# Altium schematic sheet DigitalOutputs.SchDoc
size A3; SheetNumber: 3; SheetTotal: 3
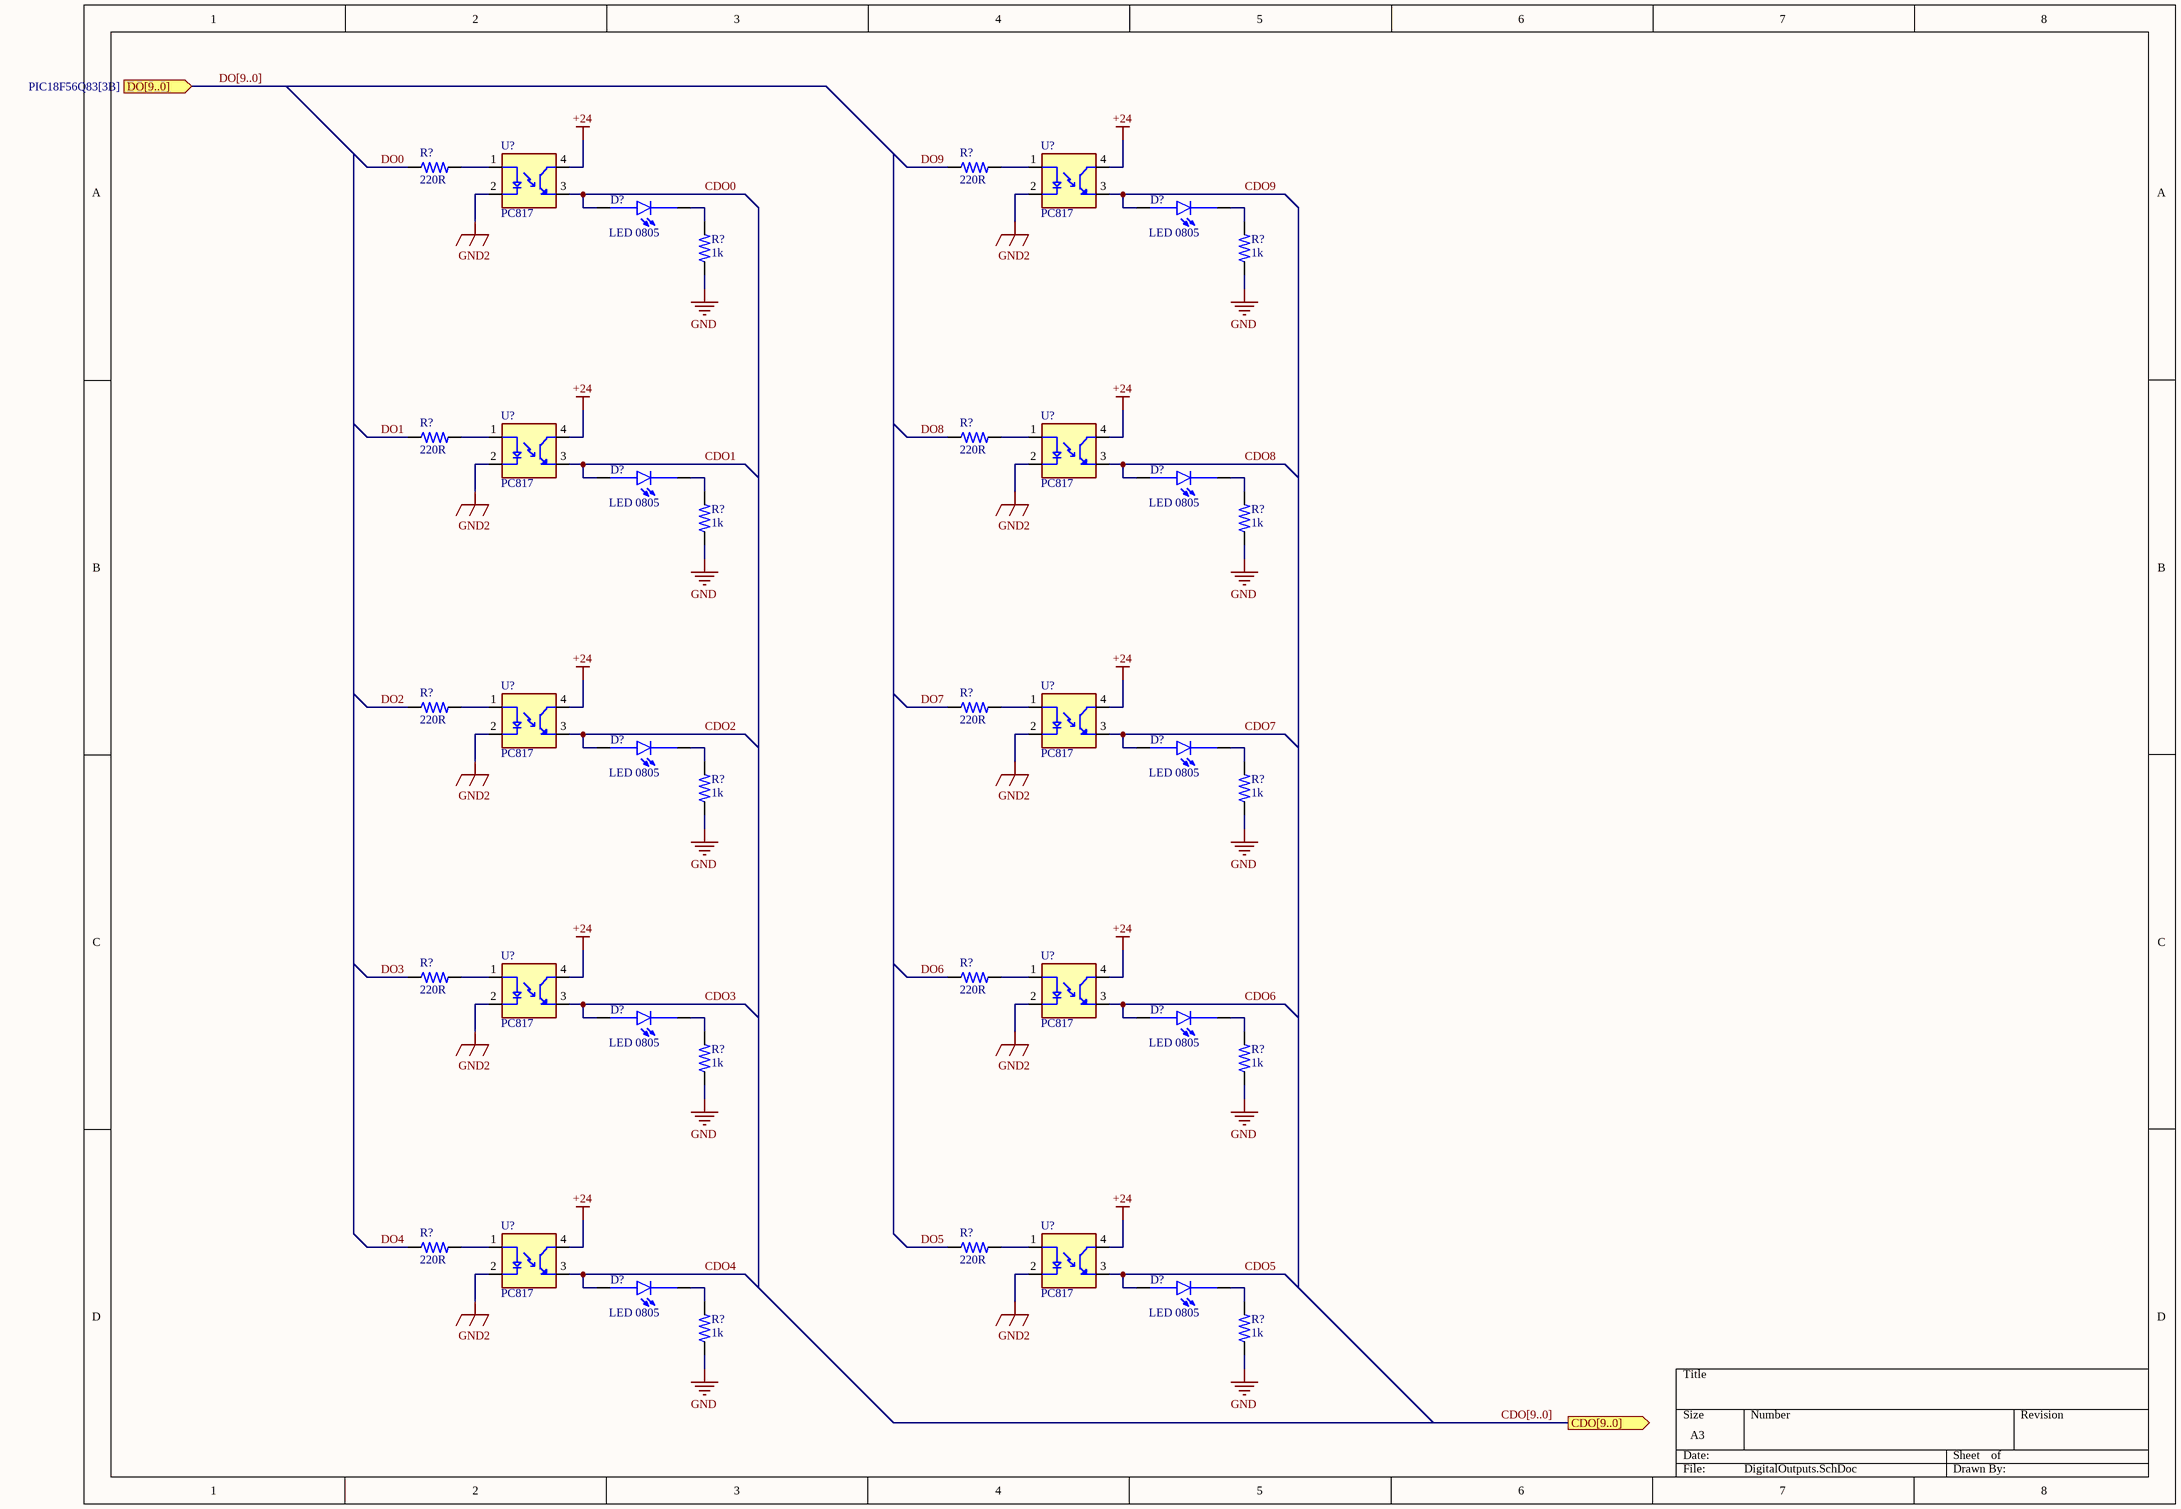
[diagram p0: DigitalOutputs.SchDoc]

## Parts
(Parts that share a designator on the sheet are numbered #1, #2 ... from top to bottom, then left to right.)
D?#1  LED 0805  [LED 0805]
D?#2  LED 0805  [LED 0805]
D?#3  LED 0805  [LED 0805]
D?#4  LED 0805  [LED 0805]
D?#5  LED 0805  [LED 0805]
D?#6  LED 0805  [LED 0805]
D?#7  LED 0805  [LED 0805]
D?#8  LED 0805  [LED 0805]
D?#9  LED 0805  [LED 0805]
D?#10  LED 0805  [LED 0805]
R?#1  220R  [0805]
R?#2  220R  [0805]
R?#3  1k  [0805]
R?#4  1k  [0805]
R?#5  220R  [0805]
R?#6  220R  [0805]
R?#7  1k  [0805]
R?#8  1k  [0805]
R?#9  220R  [0805]
R?#10  220R  [0805]
R?#11  1k  [0805]
R?#12  1k  [0805]
R?#13  220R  [0805]
R?#14  220R  [0805]
R?#15  1k  [0805]
R?#16  1k  [0805]
R?#17  220R  [0805]
R?#18  220R  [0805]
R?#19  1k  [0805]
R?#20  1k  [0805]
U?#1  PC817  [PC817]
U?#2  PC817  [PC817]
U?#3  PC817  [PC817]
U?#4  PC817  [PC817]
U?#5  PC817  [PC817]
U?#6  PC817  [PC817]
U?#7  PC817  [PC817]
U?#8  PC817  [PC817]
U?#9  PC817  [PC817]
U?#10  PC817  [PC817]

## Ports
CDO[9..0] (out), DO[9..0] (in, see PIC18F56Q83[3B])

## Nets
+24: U?#1.4(CT) U?#2.4(CT) U?#3.4(CT) U?#4.4(CT) U?#5.4(CT) U?#6.4(CT) U?#7.4(CT) U?#8.4(CT) U?#9.4(CT) U?#10.4(CT)
GND: R?#3.1 R?#4.1 R?#7.1 R?#8.1 R?#11.1 R?#12.1 R?#15.1 R?#16.1 R?#19.1 R?#20.1
GND2: U?#1.2(C) U?#2.2(C) U?#3.2(C) U?#4.2(C) U?#5.2(C) U?#6.2(C) U?#7.2(C) U?#8.2(C) U?#9.2(C) U?#10.2(C)
CDO0: D?#1.A U?#1.3(ET)
CDO1: D?#3.A U?#3.3(ET)
CDO2: D?#5.A U?#5.3(ET)
CDO3: D?#7.A U?#7.3(ET)
CDO4: D?#9.A U?#9.3(ET)
CDO5: D?#10.A U?#10.3(ET)
CDO6: D?#8.A U?#8.3(ET)
CDO7: D?#6.A U?#6.3(ET)
CDO8: D?#4.A U?#4.3(ET)
CDO9: D?#2.A U?#2.3(ET)
DO0: R?#1.1
DO1: R?#5.1
DO2: R?#9.1
DO3: R?#13.1
DO4: R?#17.1
DO5: R?#18.1
DO6: R?#14.1
DO7: R?#10.1
DO8: R?#6.1
DO9: R?#2.1
NetD?#1_C: D?#1.C R?#3.2
NetD?#2_C: D?#2.C R?#4.2
NetD?#3_C: D?#3.C R?#7.2
NetD?#4_C: D?#4.C R?#8.2
NetD?#5_C: D?#5.C R?#11.2
NetD?#6_C: D?#6.C R?#12.2
NetD?#7_C: D?#7.C R?#15.2
NetD?#8_C: D?#8.C R?#16.2
NetD?#9_C: D?#9.C R?#19.2
NetD?#10_C: D?#10.C R?#20.2
NetR?#1_2: R?#1.2 U?#1.1(A)
NetR?#2_2: R?#2.2 U?#2.1(A)
NetR?#5_2: R?#5.2 U?#3.1(A)
NetR?#6_2: R?#6.2 U?#4.1(A)
NetR?#9_2: R?#9.2 U?#5.1(A)
NetR?#10_2: R?#10.2 U?#6.1(A)
NetR?#13_2: R?#13.2 U?#7.1(A)
NetR?#14_2: R?#14.2 U?#8.1(A)
NetR?#17_2: R?#17.2 U?#9.1(A)
NetR?#18_2: R?#18.2 U?#10.1(A)

## Buses and harness runs
bus CDO[9..0] = port CDO[9..0]
bus DO[9..0] = port DO[9..0]

## Library data of the parts
D?#1-D?#10 = LED 0805: LED Uni-Color Green 4-Pin Chip 0805 T/R; MP: 597-3305-607F; Availability: Unavailable; Value: *; Price: None; Package: None
R?#1-R?#20 = 0805_Resistor: Power_Rating: .25 W; MP: 2-2176053-0; Tolerance: 1%; Resistance: .33; MF: TE Connectivity; Price: None; Availability: In Stock; EU_RoHS_Compliance: Compliant with Exemptions; Package: 0805; Value: *; SnapEDA_Link: https://www.snapeda.com/parts/2-2176053-0/TE+Connectivity/view-part/?ref=snap; Check_prices: https://www.snapeda.com/parts/2-2176053-0/TE+Connectivity/view-part/?ref=eda
U?#1-U?#10 = PC817: Optoisolator Transistor Output 5000Vrms 1 Channel 4-SMD; MP: PC817XI; MF: Sharp Microelectronics; Price: None; Availability: In Stock; Package: SMD-4 Sharp Microelectronics; Value: *; SnapEDA_Link: https://www.snapeda.com/parts/PC817XI/Sharp+Microelectronics/view-part/?ref=snap; Purchase-URL: https://pricing.snapeda.com/search/part/PC817XI/?ref=eda; Check_prices: https://www.snapeda.com/parts/PC817XI/Sharp+Microelectronics/view-part/?ref=eda